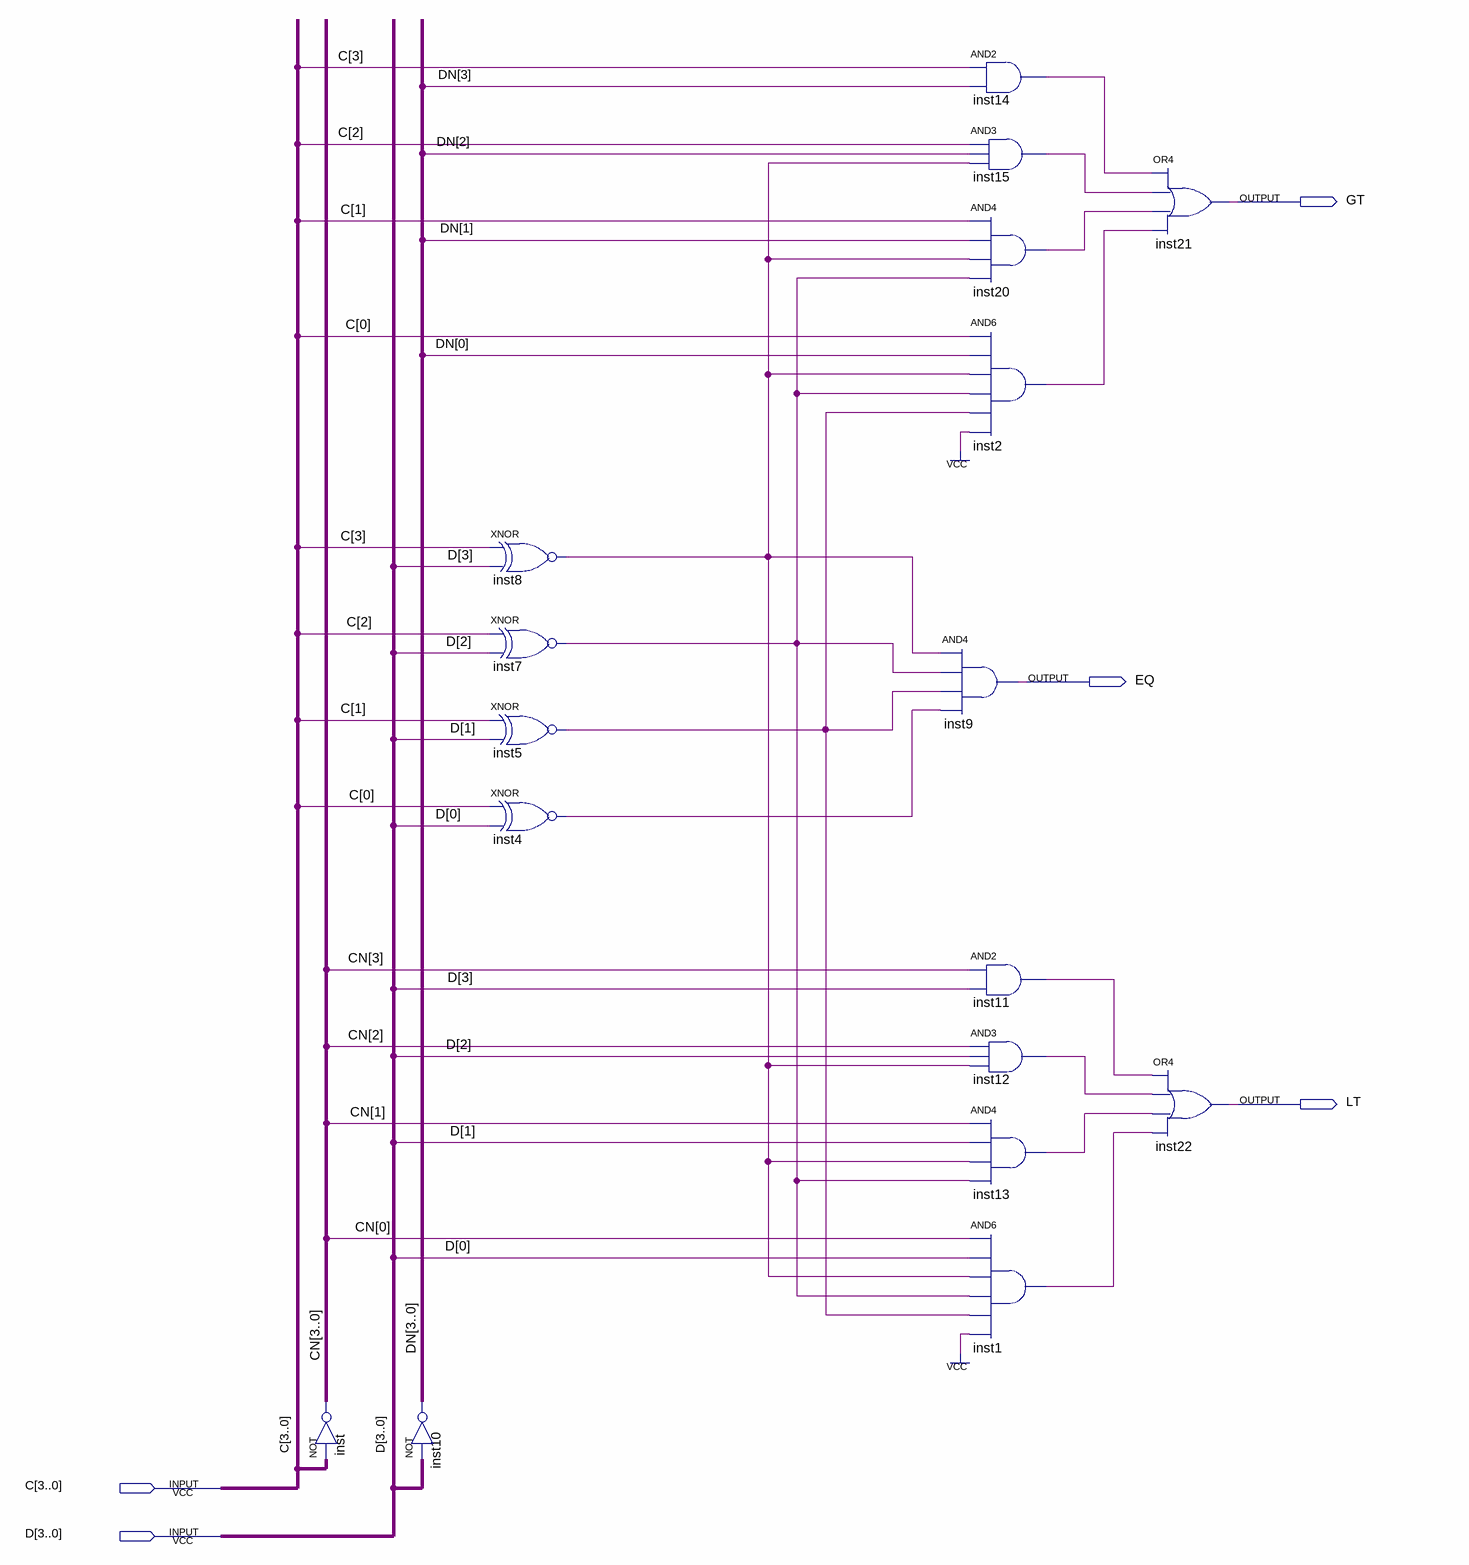
[diagram p0: schematic sheet]
// Quartus schematic Comparator4bits.bdf as structural Verilog: 17 symbols, 5 pins
module Comparator4bits (
  input  [3:0] C,
  input  [3:0] D,
  output GT,
  output EQ,
  output LT
);

  wire inst1_out, inst2_out, inst4_out, inst5_out, inst7_out, inst8_out, inst11_out, inst12_out, inst13_out,
       inst14_out, inst15_out, inst20_out;
  wire [3:0] CN, DN;

  assign CN = ~C;  // NOT inst, 4 bits wide
  assign DN = ~D;  // NOT inst10, 4 bits wide
  xnor inst8 (inst8_out, C[3], D[3]);
  xnor inst7 (inst7_out, C[2], D[2]);
  xnor inst5 (inst5_out, C[1], D[1]);
  xnor inst4 (inst4_out, C[0], D[0]);
  and inst14 (inst14_out, C[3], DN[3]);
  and inst15 (inst15_out, C[2], DN[2], inst8_out);
  and inst20 (inst20_out, C[1], DN[1], inst8_out, inst7_out);
  and inst2 (inst2_out, C[0], DN[0], inst8_out, inst7_out, inst5_out, 1'b1);
  and inst9 (EQ, inst8_out, inst7_out, inst5_out, inst4_out);
  and inst11 (inst11_out, CN[3], D[3]);
  and inst12 (inst12_out, CN[2], D[2], inst8_out);
  and inst13 (inst13_out, CN[1], D[1], inst8_out, inst7_out);
  and inst1 (inst1_out, CN[0], D[0], inst8_out, inst7_out, inst5_out, 1'b1);
  or inst21 (GT, inst14_out, inst15_out, inst20_out, inst2_out);
  or inst22 (LT, inst11_out, inst12_out, inst13_out, inst1_out);
endmodule
